# Altium schematic sheet BuzzerWithRelay.SchDoc
size B
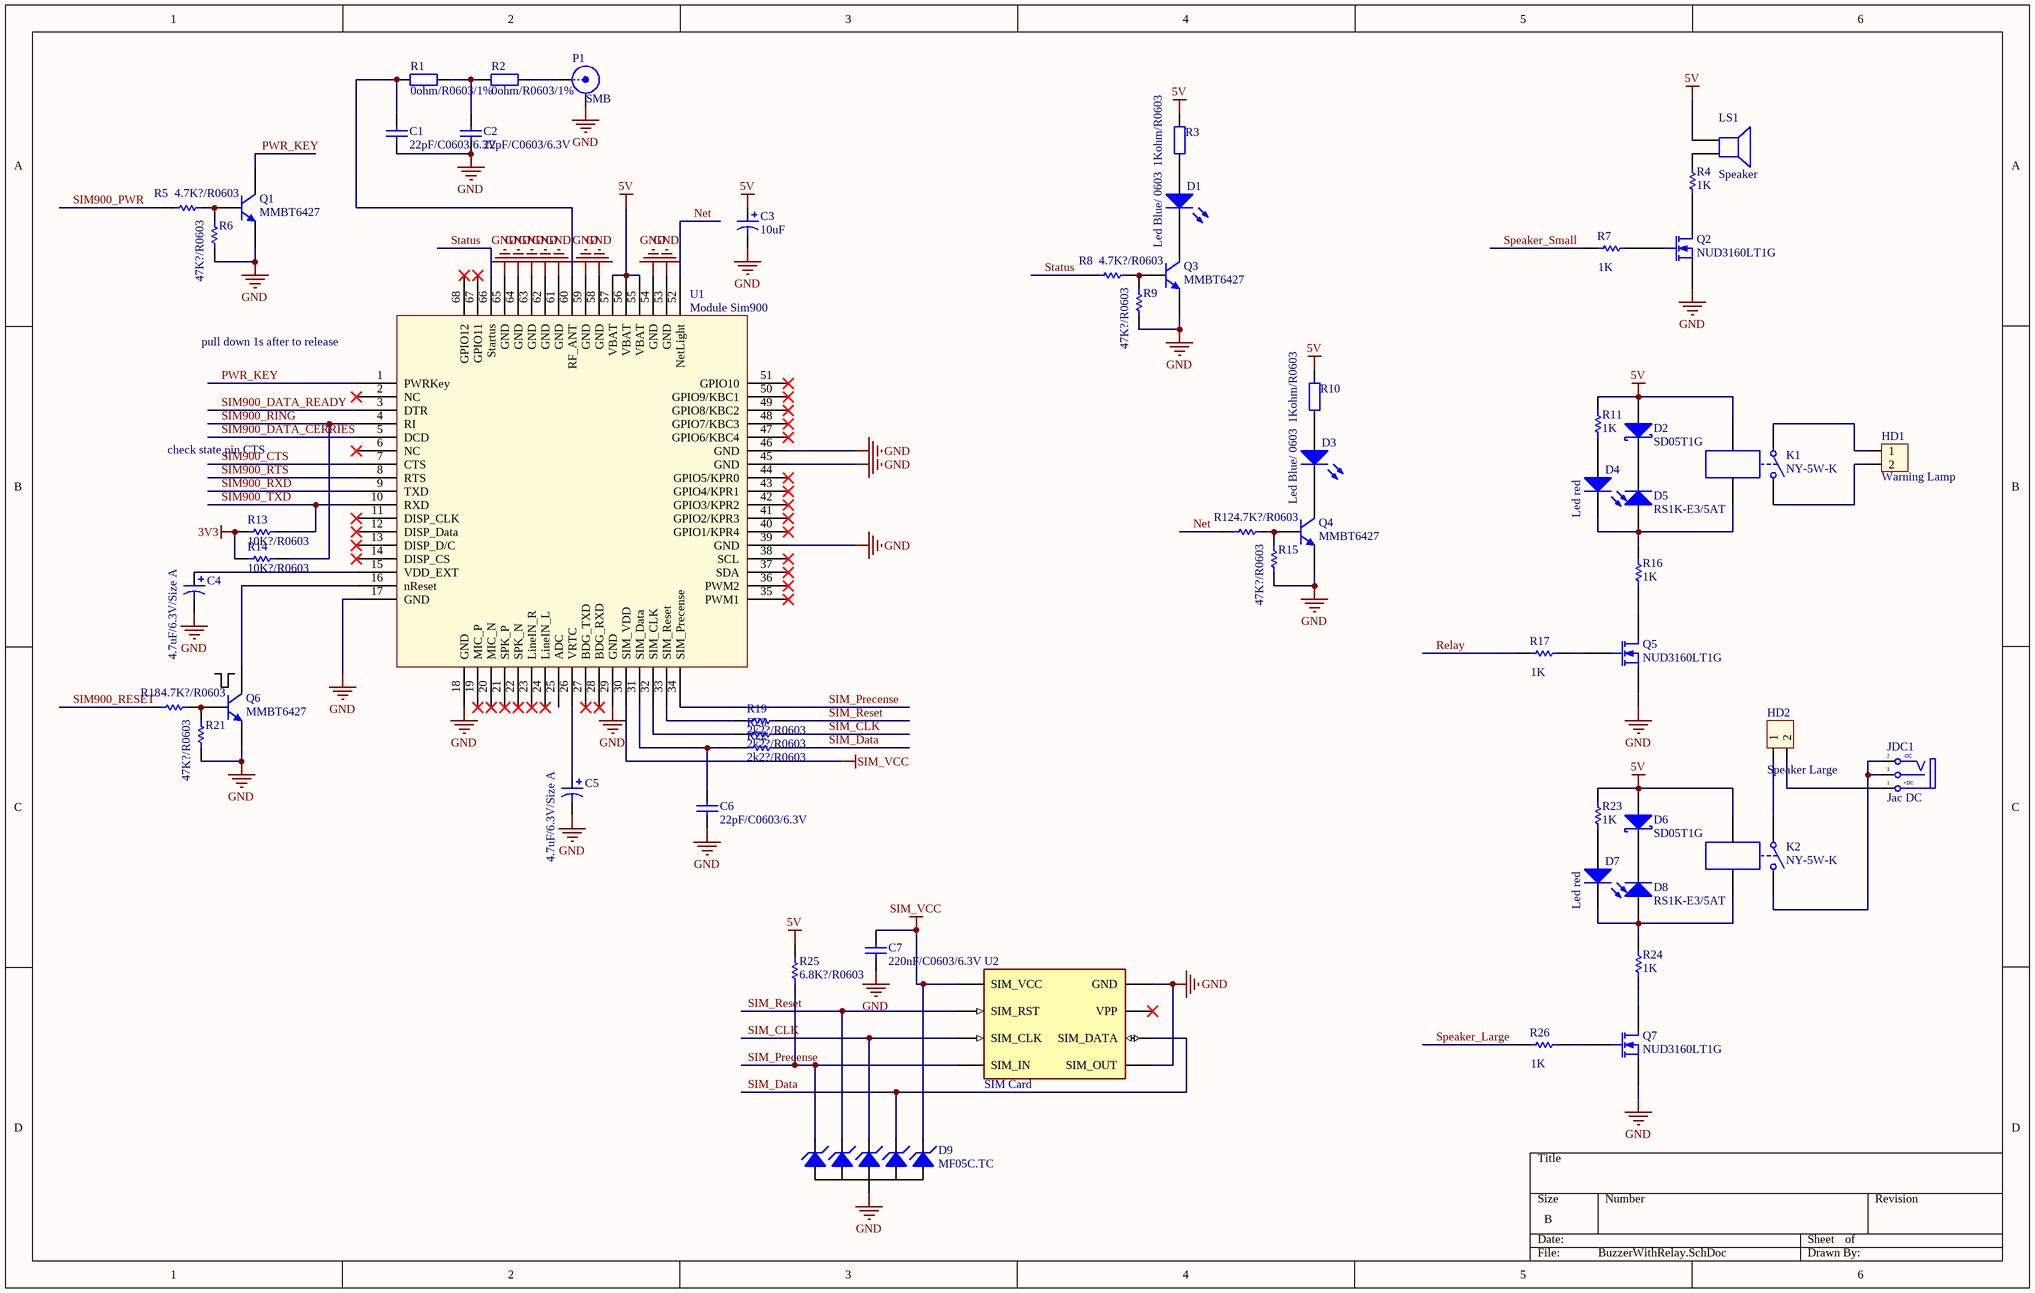
[diagram p0: BuzzerWithRelay.SchDoc]

## Parts
C1  22pF/C0603/6.3V  [C0603]
C2  22pF/C0603/6.3V  [C0603]
C3  10uF  [Cap size A]
C4  4.7uF/6.3V/Size A  [Cap size A]
C5  4.7uF/6.3V/Size A  [Cap size A]
C6  22pF/C0603/6.3V  [C0603]
C7  220nF/C0603/6.3V  [C0603]
D1  Led Blue/ 0603  [led0603]
D2  SD05T1G  [DO-214AC]
D3  Led Blue/ 0603  [led0603]
D4  Led red  [SM-LED-0805-Red]
D5  RS1K-E3/5AT  [DO-214AC]
D6  SD05T1G  [DO-214AC]
D7  Led red  [SM-LED-0805-Red]
D8  RS1K-E3/5AT  [DO-214AC]
D9  MF05C.TC  [SC70]
HD1  Warning Lamp  [HED2]
HD2  Speaker Large  [HED2]
JDC1  Jac DC  [DC-IN]
K1  NY-5W-K  [Relay NY seri]
K2  NY-5W-K  [Relay NY seri]
LS1  Speaker  [Buzzer]
P1  SMB  [atena MM9329-2700]
Q1  MMBT6427  [SOT 23]
Q2  NUD3160LT1G  [SOT 23]
Q3  MMBT6427  [SOT 23]
Q4  MMBT6427  [SOT 23]
Q5  NUD3160LT1G  [SOT 23]
Q6  MMBT6427  [SOT 23]
Q7  NUD3160LT1G  [SOT 23]
R1  0ohm/R0603/1%  [R0603]
R2  0ohm/R0603/1%  [R0603]
R3  1Kohm/R0603  [R0603]
R4  value 1K  [R0603]  (hidden comment: Res1)
R5  4.7K?/R0603  [R0603]
R6  47K?/R0603  [R0603]
R7  value 1K  [R0603]  (hidden comment: Res1)
R8  4.7K?/R0603  [R0603]
R9  47K?/R0603  [R0603]
R10  1Kohm/R0603  [R0603]
R11  value 1K  [SM-RES-0805]  (hidden comment: Res1)
R12  4.7K?/R0603  [R0603]
R13  10K?/R0603  [R0603]
R14  10K?/R0603  [R0603]
R15  47K?/R0603  [R0603]
R16  value 1K  [SM-RES-0805]  (hidden comment: Res1)
R17  value 1K  [SM-RES-0805]  (hidden comment: Res1)
R18  4.7K?/R0603  [R0603]
R19  2k2?/R0603  [R0603]
R20  2k2?/R0603  [R0603]
R21  47K?/R0603  [R0603]
R22  2k2?/R0603  [R0603]
R23  value 1K  [SM-RES-0805]  (hidden comment: Res1)
R24  value 1K  [SM-RES-0805]  (hidden comment: Res1)
R25  6.8K?/R0603  [R0603]
R26  value 1K  [SM-RES-0805]  (hidden comment: Res1)
U1  Module Sim900  [Sim900]
U2  SIM Card  [SIMCARD]

## Nets
3V3: R13.1 R14.1
5V: C3.1(+) D2.2 D6.2 K1.3 K2.3 LS1.+ R3.2 R10.2 R11.2 R23.2 R25.1 U1.55(VBAT) U1.56(VBAT) U1.57(VBAT)
GND: C1.1 C2.1 C3.2(-) C4.2 C5.2 C6.1 C7.1 D9.2(K) P1.2(Y) Q1.2(E) Q2.2(S) Q3.2(E) Q4.2(E) Q5.2(S) Q6.2(E) Q7.2(S) R6.1 R9.1 R15.1 R21.1 U1.17(GND) U1.18(GND) U1.29(GND) U1.39(GND) U1.45(GND) U1.46(GND) U1.53(GND) U1.54(GND) U1.58(GND) U1.59(GND) U1.61(GND) U1.62(GND) U1.63(GND) U1.64(GND) U1.65(GND) U2.C5(GND) U2.C8(SIM_OUT)
SIM_VCC: C7.2 D9.6(K) U1.30(SIM_VDD) U2.C1(SIM_VCC)
Net: R12.1 U1.52(NetLight)
PWR_KEY: Q1.3(C) U1.1(PWRKey)
Relay: R17.1
SIM900_CTS: U1.7(CTS)
SIM900_DATA_CERRIES: U1.5(DCD)
SIM900_DATA_READY: U1.3(DTR)
SIM900_PWR: R5.1
SIM900_RESET: R18.1
SIM900_RING: R14.2 U1.4(RI)
SIM900_RTS: U1.8(RTS)
SIM900_RXD: U1.9(TXD)
SIM900_TXD: R13.2 U1.10(RXD)
SIM_CLK: D9.4(K) R20.1 U2.C3(SIM_CLK)
SIM_Data: D9.5(K) R22.1 U2.C7(SIM_DATA)
SIM_Precense: D9.1(K) R25.2 U1.34(SIM_Precense) U2.C4(SIM_IN)
SIM_Reset: D9.3(K) R19.1 U2.C2(SIM_RST)
Speaker_Large: R26.1
Speaker_Small: R7.1
Status: R8.1 U1.66(Startus)
NetC1_2: C1.2 R1.2 U1.60(RF_ANT)
NetC2_2: C2.2 R1.1 R2.2
NetC4_1: C4.1 U1.15(VDD_EXT)
NetC5_1: C5.1 U1.26(VRTC)
NetC6_2: C6.2 R22.2 U1.31(SIM_Data)
NetD1_1: D1.1(A) R3.1
NetD1_2: D1.2(K) Q3.3(C)
NetD2_1: D2.1 D5.2(K)
NetD3_1: D3.1(A) R10.1
NetD3_2: D3.2(K) Q4.3(C)
NetD4_1: D4.1(A) R11.1
NetD4_2: D4.2(K) D5.1(A) K1.4 R16.2
NetD6_1: D6.1 D8.2(K)
NetD7_1: D7.1(A) R23.1
NetD7_2: D7.2(K) D8.1(A) K2.4 R24.2
NetHD1_1: HD1.1 K1.1
NetHD1_2: HD1.2 K1.2
NetHD2_1: HD2.1 K2.1
NetHD2_2: HD2.2 JDC1.1(T)
NetJDC1_2: JDC1.2(TN) JDC1.3(S) K2.2
NetLS1_-: LS1.- R4.2
NetP1_1: P1.1(X) R2.1
NetQ1_1: Q1.1(B) R5.2 R6.2
NetQ2_1: Q2.1(G) R7.2
NetQ2_3: Q2.3(D) R4.1
NetQ3_1: Q3.1(B) R8.2 R9.2
NetQ4_1: Q4.1(B) R12.2 R15.2
NetQ5_1: Q5.1(G) R17.2
NetQ5_3: Q5.3(D) R16.1
NetQ6_1: Q6.1(B) R18.2 R21.2
NetQ6_3: Q6.3(C) U1.16(nReset)
NetQ7_1: Q7.1(G) R26.2
NetQ7_3: Q7.3(D) R24.1
NetR19_2: R19.2 U1.33(SIM_Reset)
NetR20_2: R20.2 U1.32(SIM_CLK)

Not connected (* = marked no-connect by the designer): U1 2(NC)* 6(NC)* 11(DISP_CLK)* 12(DISP_Data)* 13(DISP_D/C)* 14(DISP_CS)* 19(MIC_P)* 20(MIC_N)* 21(SPK_P)* 22(SPK_N)* 23(LineIN_R)* 24(LineIN_L)* 25(ADC) 27(BDG_TXD)* 28(BDG_RXD)* 35(PWM1)* 36(PWM2)* 37(SDA)* 38(SCL)* 40(GPIO1/KPR4)* 41(GPIO2/KPR3)* 42(GPIO3/KPR2)* 43(GPIO4/KPR1)* 44(GPIO5/KPR0)* 47(GPIO6/KBC4)* 48(GPIO7/KBC3)* 49(GPIO8/KBC2)* 50(GPIO9/KBC1)* 51(GPIO10)* 67(GPIO11)* 68(GPIO12)*; U2 C6(VPP)*

## Notes on the sheet
- (near U1) pull down 1s after to release
- check state pin CTS
- (in symbol DCIN) -DC; +DC

## Library data of the parts
C1 C2 C6 C7 = Cap: Capacitor; Muf: Murata/Japan; Des: Ceramic Cap; Property: Cap; Price: *
  C1 C2 C6: Ordering: 22pF/C0603/6.3V
  C7: Ordering: 220nF/C0603/6.3V
C3 = 10uF/25V/RADIAL 5X11/20%: Aluminum Electrolytic Capacitors - Leaded 10uF 25V; Manufacturer: Panasonic; Manufacturer Part Number: ECA-1EM100; Tolerance: 20 %; Type: Radial Lead Type; Life: 2000 Hour; Ripple Current: 50 mA; Supplier 1: Mouser; RoHS: RoHS Compliant; Category: Aluminum Electrolytic Capacitors - Leaded; Stock 1: 19378; Pricing 1: 1=0.288, 10=0.117, 100=0.069, 1000=0.061, 2500=0.053, 10000=0.050, 25000=0.048, 50000=0.045 (AUD); Capacitance: 10 uF; Diameter: 5 mm; Dimensions: 5 mm Dia. x 11 mm L; Length: 11 mm; Package / Case: Radial, Can; Packaging: Bulk; Product: General Purpose Electrolytic Capacitors; Series: M; Termination Style: Radial; Voltage Rating DC: 25 V; Brand: Panasonic; Lead Spacing: 2 mm; Lead Style: Straight; Maximum Operating Temperature: + 85 C; Product Category: Radial Electrolytic Aluminum Capacitors; Standard Pack Qty: 200; RoHS - Mouser: Y; Minimum Order Quantity: 1; Reeling: False; ComponentLink1URL: http://www.mouser.com/ds/2/315/ABA0000CE12-465472.pdf; ComponentLink1Description: http://www.mouser.com/ds/2/315/ABA0000CE12-465472.pdf
C4 C5 = Cap Pol1: Polarized Capacitor (Radial); Muf: Vishay; Property: Tantalum Cap; Ordering: 4.7uF/6.3V/Size A; Price: *; Des: *
D1 D3 = LED0: Typical INFRARED GaAs LED; Muf: China Mainland; Ordering: Led Blue/ 0603; Price: *; Des: *; Property: Led
D2 D6 = Transil: Des: SD05T1 Series 7.3V 350W Uni Directiional Transient Voltage Suppressor - SOD-323; Muf: ON; Property: TVS; Ordering: SD05T1G; Value: SD05T1G; Price: 0.09
D4 D7 = LED0: Typical INFRARED GaAs LED; Des: Led singal; Muf: Everlight; Value: Led red; Price: 0.02; Ordering: Led 0805; Property: Led
D5 D8 = Diode: Default Diode; Des: RS1K Series 800 V 1 A Surface Mount Fast Switching Rectifier - DO-214AC; Muf: VISHAY; Value: RS1K-E3/5AT; Property: Diode; Price: 0.05; Ordering: RS1K-E3/5AT
D9 = SMF05C: TVS Diode Array  For ESD and Latch-Up Protection; Muf: SEMTECH/USA; Ordering: MF05C.TC; Price: *; Des: TVS Diode Array; Property: TVS Diode
HD1 HD2 = Hed2: Header 2 (Green); Value: Header 2
JDC1 = DCIN: Jac DC input; Value: Jac DC
K1 K2 = Relay-SPST: Single-Pole Single-Throw Relay; Muf: Fujitsu; Des: General Purpose Relays POWER; Property: Power Relays; Ordering: NY-5W-K; Price: 2.27; Value: NY-5W-K
LS1 = Speaker: Loudspeaker; Published: 24-Mar-1999; LatestRevisionDate: 17-Jul-2002; LatestRevisionNote: Re-released for DXP Platform.; PackageReference: PIN2; Publisher: Altium Limited
P1 = SMB: SMB Straight Connector; LatestRevisionDate: 17-Jul-2002; LatestRevisionNote: Re-released for DXP Platform.; Publisher: Altium Limited
Q1 Q3 Q4 Q6 = NPN: NPN Bipolar Transistor; Muf: Fairchild; Ordering: MMBT6427; Des: *; Property: *; Price: 0.4RMB
Q2 Q5 Q7 = MOSFET-N: SSM3K337R; Des: MOSFET 61V Industrial Load Driver; Muf: ON Semiconductor; Property: Mosfet; Price: 0.57; Ordering: NUD3160LT1G; Value: NUD3160LT1G
R1 R2 = Res2: Resistor; Property: Res; Muf: China Mainland; Ordering: 0ohm/R0603/1%; Des: *; Price: *
R3 R10 = Res2: Resistor; Property: Res; Ordering: 1Kohm/R0603; Vishay/USA: *; Price: 0.023RMB; Des: *
R4 R7 R11 R16 R17 R23 R24 R26 = Res1: Resistor; Published: 8-Jun-2000; LatestRevisionDate: 17-Jul-2002; LatestRevisionNote: Re-released for DXP Platform.; PackageReference: AXIAL-0.3; Publisher: Altium Limited; PackageDescription: Axial Device, Thru-Hole; 2 Leads; 0.3 in Pin Spacing
R5 R6 R8 R9 R12-R15 R18-R22 R25 = Res1: Resistor; Muf: Vishay/USA; Property: Res; Des: *
  R5 R8 R12 R18: Ordering: 4.7K?/R0603
  R6 R9 R15 R21: Ordering: 47K?/R0603
  R13 R14: Ordering: 10K?/R0603
  R19 R20 R22: Ordering: 2k2?/R0603
  R25: Ordering: 6.8K?/R0603
U1 = SIM900: GSM-GPRS; Muf: SimCom; Price: *; Des: *; Property: Module; Ordering: Module Sim900